# Altium project POSEDGE_Wing_8_template.PrjPcb
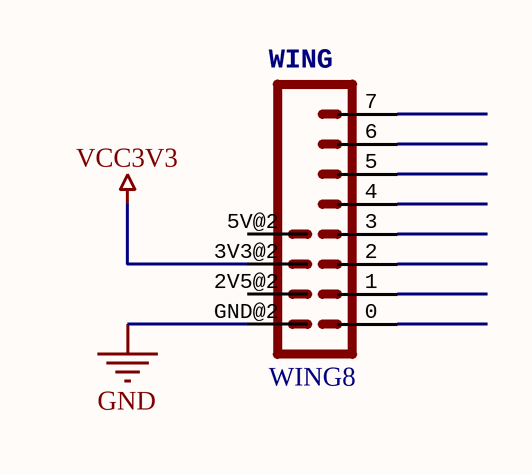
[diagram p0: POSEDGE_Wing_8_template.SchDoc]
1 sheet, 1 parts. Net scope: global (net labels, ports and power ports of the same name join across sheets).
Board file: POSEDGE_wing_8_template.PcbDoc

## Sheet POSEDGE_Wing_8_template.SchDoc: POSEDGE 8-bit Wing Template
size A4; Organization: www.posedge.ir

### Parts
WING  WING8  [WINGSIDE_8BIT]

### Nets
GND: WING.GND@2(GND)
VCC3V3: WING.3V3@2(3V3)

Not connected (* = marked no-connect by the designer): WING 0(1) 1(2) 2(3) 2V5@2(2V5) 3(4) 4(5) 5(6) 5V@2(5V) 6(7) 7(8)

### Notes on the sheet
- Title
- Size:
- Date:
- A4
- Number:
- Revision:
- Sheet
- of